# Altium schematic sheet hot_board.SchDoc
size A4
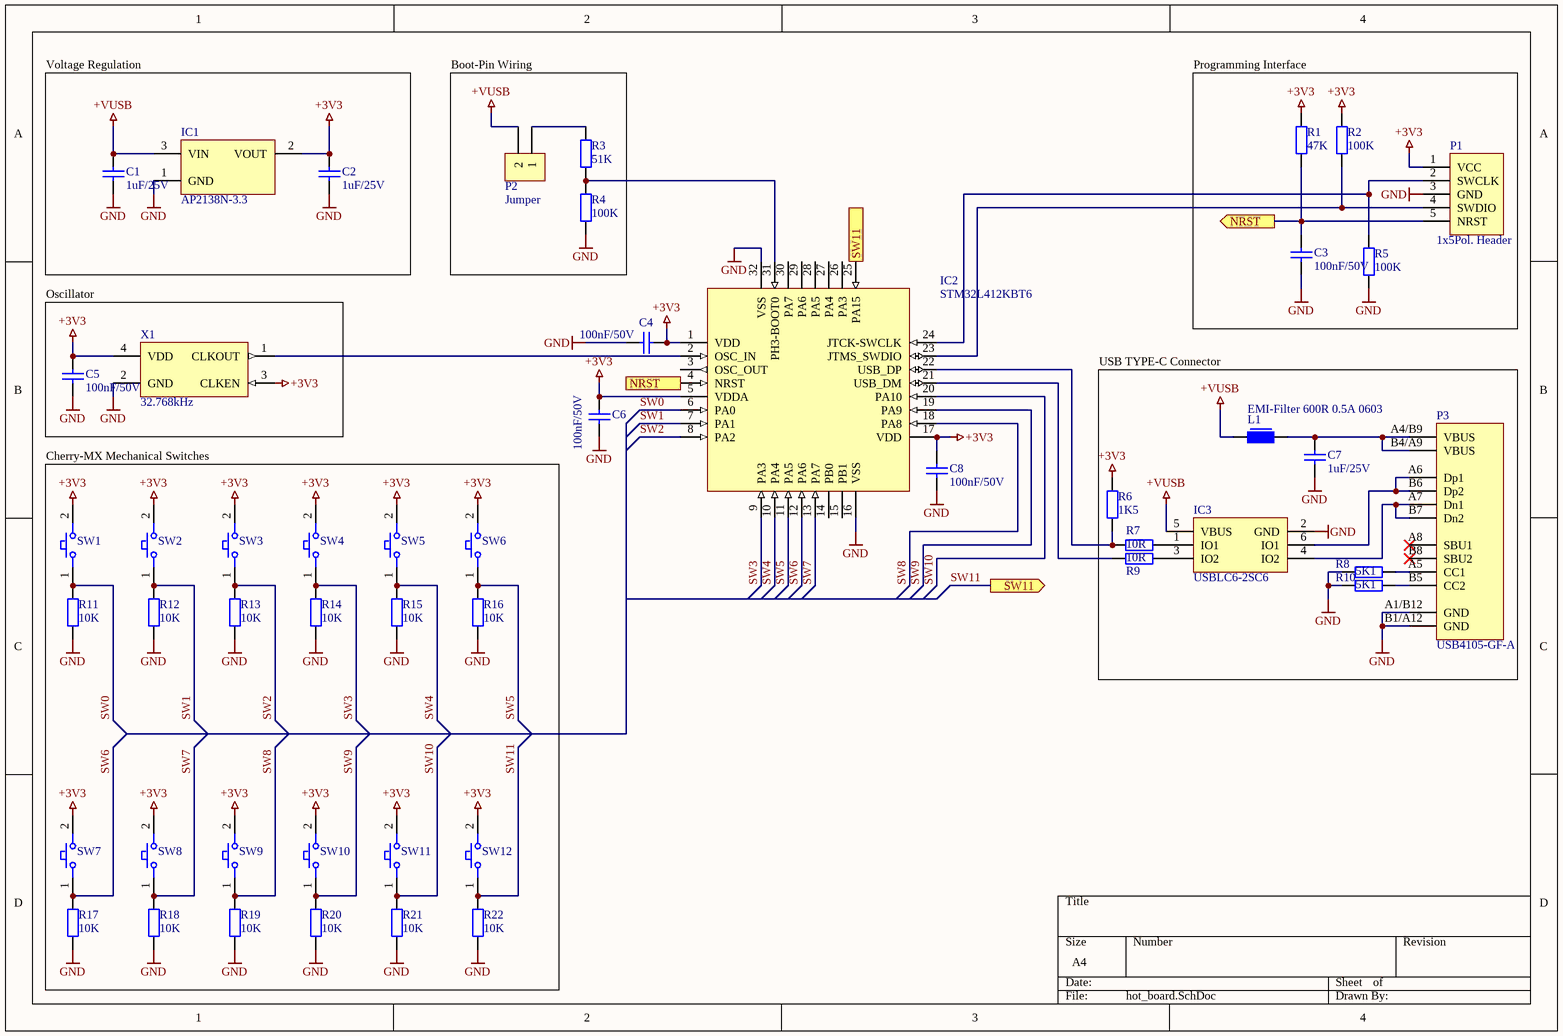
[diagram p0: hot_board.SchDoc]

## Parts
C1  1uF/25V  [0603]
C2  1uF/25V  [0603]
C3  100nF/50V  [0603]
C4  100nF/50V  [0603]
C5  100nF/50V  [0603]
C6  100nF/50V  [0603]
C7  1uF/25V  [0603]
C8  100nF/50V  [0603]
IC1  AP2138N-3.3  [SOT23-3]
IC2  STM32L412KBT6  [LQFP-32]
IC3  USBLC6-2SC6  [SOT23-6]
L1  EMI-Filter 600R 0.5A 0603  [0603]
P1  1x5Pol. Header  [1x5 Header]
P2  Jumper  [1x2 Header]
P3  USB4105-GF-A  [USB_SMD]
R1  47K  [0603]
R2  100K  [0603]
R3  51K  [0603]
R4  100K  [0603]
R5  100K  [0603]
R6  1K5  [0603]
R7  10R  [0603]
R8  5K1  [0603]
R9  10R  [0603]
R10  5K1  [0603]
R11  10K  [0603]
R12  10K  [0603]
R13  10K  [0603]
R14  10K  [0603]
R15  10K  [0603]
R16  10K  [0603]
R17  10K  [0603]
R18  10K  [0603]
R19  10K  [0603]
R20  10K  [0603]
R21  10K  [0603]
R22  10K  [0603]
SW1  Switch_Cherry_MX1A-E1NN_eec  [Cherry_MX1A-E1NN_0]  (value not drawn)
SW2  Switch_Cherry_MX1A-E1NN_eec  [Cherry_MX1A-E1NN_0]  (value not drawn)
SW3  Switch_Cherry_MX1A-E1NN_eec  [Cherry_MX1A-E1NN_0]  (value not drawn)
SW4  Switch_Cherry_MX1A-E1NN_eec  [Cherry_MX1A-E1NN_0]  (value not drawn)
SW5  Switch_Cherry_MX1A-E1NN_eec  [Cherry_MX1A-E1NN_0]  (value not drawn)
SW6  Switch_Cherry_MX1A-E1NN_eec  [Cherry_MX1A-E1NN_0]  (value not drawn)
SW7  Switch_Cherry_MX1A-E1NN_eec  [Cherry_MX1A-E1NN_0]  (value not drawn)
SW8  Switch_Cherry_MX1A-E1NN_eec  [Cherry_MX1A-E1NN_0]  (value not drawn)
SW9  Switch_Cherry_MX1A-E1NN_eec  [Cherry_MX1A-E1NN_0]  (value not drawn)
SW10  Switch_Cherry_MX1A-E1NN_eec  [Cherry_MX1A-E1NN_0]  (value not drawn)
SW11  Switch_Cherry_MX1A-E1NN_eec  [Cherry_MX1A-E1NN_0]  (value not drawn)
SW12  Switch_Cherry_MX1A-E1NN_eec  [Cherry_MX1A-E1NN_0]  (value not drawn)
X1  32.768kHz  [Quartz]

## Blocks framed on the sheet
Voltage Regulation: C1 C2 IC1
Boot-Pin Wiring: P2 R3 R4
Programming Interface: C3 P1 R1 R2 R5
Oscillator: C5 X1
USB TYPE-C Connector: C7 IC3 L1 P3 R6-R10
Cherry-MX Mechanical Switches: R11-R22 SW1-SW12

## Ports
NRST (in), NRST (out), SW11 (in), SW11 (out)

## Nets
+3V3: C2.1 C4.2 C5.2 C6.2 C8.2 IC1.2(VOUT) IC2.1(VDD) IC2.5(VDDA) IC2.17(VDD) P1.1(VCC) R1.2 R2.2 R6.1 SW1.2 SW2.2 SW3.2 SW4.2 SW5.2 SW6.2 SW7.2 SW8.2 SW9.2 SW10.2 SW11.2 SW12.2 X1.3(CLKEN) X1.4(VDD)
+VUSB: C1.1 IC1.3(VIN) IC3.5(VBUS) L1.1 P2.2
GND: C1.2 C2.2 C3.1 C4.1 C5.1 C6.1 C7.2 C8.1 IC1.1(GND) IC2.16(VSS) IC2.32(VSS) IC3.2(GND) P1.3(GND) P3.A1/B12(GND) P3.B1/A12(GND) R4.1 R5.1 R8.1 R10.1 R11.2 R12.2 R13.2 R14.2 R15.2 R16.2 R17.2 R18.2 R19.2 R20.2 R21.2 R22.2 X1.2(GND)
NRST: C3.2 IC2.4(NRST) P1.5(NRST) R1.1 ; port NRST
SW0: IC2.6(PA0) R11.1 SW1.1
SW1: IC2.7(PA1) R12.1 SW2.1
SW2: IC2.8(PA2) R13.1 SW3.1
SW3: IC2.9(PA3) R14.1 SW4.1
SW4: IC2.10(PA4) R15.1 SW5.1
SW5: IC2.11(PA5) R16.1 SW6.1
SW6: IC2.12(PA6) R17.1 SW7.1
SW7: IC2.13(PA7) R18.1 SW8.1
SW8: IC2.18(PA8) R19.1 SW9.1
SW9: IC2.19(PA9) R20.1 SW10.1
SW10: IC2.20(PA10) R21.1 SW11.1
SW11: IC2.25(PA15) R22.1 SW12.1 ; port SW11
NetC7_1: C7.1 L1.2 P3.A4/B9(VBUS) P3.B4/A9(VBUS)
NetIC2_2: IC2.2(OSC_IN) X1.1(CLKOUT)
NetIC2_21: IC2.21(USB_DM) R9.1
NetIC2_22: IC2.22(USB_DP) R6.2 R7.1
NetIC2_23: IC2.23(JTMS_SWDIO) P1.4(SWDIO) R2.1
NetIC2_24: IC2.24(JTCK-SWCLK) P1.2(SWCLK) R5.2
NetIC2_31: IC2.31(PH3-BOOT0) R3.1 R4.2
NetIC3_1: IC3.1(IO1) R7.2
NetIC3_3: IC3.3(IO2) R9.2
NetIC3_4: IC3.4(IO2) P3.A7(Dn1) P3.B7(Dn2)
NetIC3_6: IC3.6(IO1) P3.A6(Dp1) P3.B6(Dp2)
NetP2_1: P2.1 R3.2
NetP3_A5: P3.A5(CC1) R8.2
NetP3_B5: P3.B5(CC2) R10.2

Not connected (* = marked no-connect by the designer): IC2 3(OSC_OUT) 14(PB0) 15(PB1) 26(PA3) 27(PA4) 28(PA5) 29(PA6) 30(PA7); P3 A8(SBU1)* B8(SBU2)*

## Library data of the parts
C1 C2 C7 = 1uF_0603_25V: Keramikkondensator, 1uF, 25V, 10%, SMD 0603, X5R; Artikelnummer_HEK: 1280791; Artikelnummer_FA: 1735540; Richtpreis_EURO: 0.01; Artikelnummer_MOU: 80-C0603C105K3PAC; Hersteller: Kemet; Artikelnummer_SAP: *; Artikelnummer_DIS: *; Info: *; Datum: 03.10.2010; HelpURL: *; Bestückung: *; Dielektrikum: X5R
C3-C6 C8 = 100nF_0603_50V: Keramikkondensator, 100nF, 50V, 10%, SMD 0603, X7R; Artikelnummer_HEK: 1280316; Artikelnummer_FA: 1362556; Richtpreis_EURO: 0.0017; Artikelnummer_DIS: *; Artikelnummer_SAP: *; Info: *; Datum: 08.06.06; HelpURL: http://hk79295n10/idmws/doccontent.dll?library=hekatron^hk79295n11&id=003751259
IC1 = AP2138N-3.3: PMIC - Spannungsregler - Linear 1 Ausgang 250mA SOT-23-3
IC2 = STM32L412KBT6: Ultra-low-power with FPU Arm Cortex-M4 MCU 80 MHz with 128-Kbyte of Flash memory, USB
IC3 = USBLC6-2SC6: 17V Klemme 5 A (8/20µs) Ipp TVS - Dioden Oberflächenmontage SOT-23-6
L1 = EMI-Filter 600R 0.5A 0603: Ferrit EMI Filter, 100MHz, 25%, 600 Ohm, 0.5A, SMD 0603; Artikelnummer_HEK: 1020415; Artikelnummer_FA: 1515723; Info: Murata: BLM18EG601SN1D; Richtpreis_EURO: 0.0183; Artikelnummer_SAP: *; Artikelnummer_DIS: *; Datum: 10.06.12; Bestückung: *; HelpURL: *
P1 = SWD-Connector: SWD Connector for Programming
P2 = Jumper: Header 1x2pol; Artikelnummer_HEK: 2520674; Richtpreis_EURO: 0.2; System: Connector; SMD: N; HelpURL: http://dmshekatron.securiton.int/idmwsout/doccontent.dll?library=hekatron^hk79295n11&id=004881205; Artikelnummer_DIS: *; Artikelnummer_FA: *; Artikelnummer_SAP: *; Datum: *; Info: *; Bestückung: *
P3 = USB_C_Connector: USB4105-GF-A‎ / USB2.0 TYPEC
R1 = 47K_0603_0.125W: 47K Chip-Widerstand, 1%, 0.125W, 0603; Artikelnummer_HEK: 1191450; Artikelnummer_FA: 1576305; Artikelnummer_DIS: 715628; Richtpreis_EURO: 0.01; Artikelnummer_SAP: *; Datum: 20.12.06; Info: *; HelpURL: http://hk79295n10/idmws/doccontent.dll?library=hekatron^hk79295n11&id=004062332; Bestückung: *
R2 R4 R5 = 100K_0603_0.1W: 100K Chip-Widerstand, 1%, 0.063W, 0603; Artikelnummer_HEK: 1190787; Richtpreis_EURO: 0.0003; Artikelnummer_SAP: *; Artikelnummer_DIS: *; Artikelnummer_FA: *; Info: *; Datum: 20.03.14; Bestückung: *; HelpURL: *
R3 = 51K_0603_0.1W: 51K Chip-Widerstand, 1%. 0.1W, 0603; Artikelnummer_HEK: 1191872; Artikelnummer_FA: 1799349; Richtpreis_EURO: 0.01; Artikelnummer_DIS: *; Artikelnummer_SAP: *; Info: *; Datum: 14.05.10; HelpURL: http://hk79295n10/IDMWSout/doccontent.dll?library=hekatron^hk79295n11&id=004064519; Bestückung: *
R6 = 1K5_0603_0.100W: 1K5 Chip-Widerstand, 1%, 0.100W, 0603; Artikelnummer_HEK: 1191340; Richtpreis_EURO: 0.0004; Artikelnummer_DIS: *; Artikelnummer_SAP: *; Artikelnummer_FA: *; Datum: 20.03.14; Info: *; Bestückung: *; HelpURL: *
R7 R9 = 10R_0603_0.125W: 10R Chip-Widerstand, 1%, 0.125W, 0603; Artikelnummer_HEK: 1191543; Artikelnummer_FA: 1576250; Richtpreis_EURO: 0.01; Artikelnummer_DIS: *; Artikelnummer_SAP: *; Info: *; Datum: 26.04.06; Bestückung: *; HelpURL: *
R8 R10 = 5K1_0603_0.1W: 5K1 Chip-Widerstand, 1%. 0.1W, 0603; Artikelnummer_HEK: 1191429; Artikelnummer_DIS: 715605; Richtpreis_EURO: 0.0004; Artikelnummer_FA: *; Info: *; Datum: 26.04.06
R11-R22 = 10K_0603_0.1W: 10K Chip-Widerstand, 1%, 0.1W, 0603; Artikelnummer_HEK: 1190782; Richtpreis_EURO: 0.0001; Artikelnummer_FA: *; Artikelnummer_DIS: *; Artikelnummer_SAP: *; Info: *; Datum: 20.03.14; Bestückung: *; HelpURL: *
SW1-SW12 = Switch_Cherry_MX1A-E1NN_eec: SWITCH Pushbutton Switch SPST-NO Keyswitch Panel Mount, Front; Manufacturer: Cherry; Current: 10mA AC/DC max. 10µA DC min.; Voltage: 12 VAC/DC max. 2 VDC min.; Part Number: MX1A-E1NN; helpURL: https://upverter.com/upn/revision/05edf2e9883387c2/; ComponentLink2Description: Datasheet; Temperature: -10°C to +70°C; Package: SMT_SW_15MM6_15MM6; Supplier 2: Mouser; Price: 0.741007758432; Supplier 1: Digi-Key; ComponentLink1URL: https://upverter.com/upn/revision/05edf2e9883387c2/; Supplier Part Number 2: 540-MX1A-E1NN; Supplier Part Number 1: CH196-ND; ComponentLink1Description: Upverter; ComponentLink2URL: https://upverter.com/datasheet/a174b925b05052267a652262a41f429ea7a87855.pdf; RoHS: TRUE; Mouser Part Number: 540-MX1A-E1NN; Temperature Range High: +70°C; Digikey Description: SWITCH Pushbutton Switch SPST-NO Keyswitch Panel Mount, Front; Digikey Part Number: CH196-ND; Lead Free: yes; Circuit: SPST-NO; Temperature Range Low: -10°C
X1 = Oszillator_32.765kHz: 32,768kHz CMOS XO-Norm Oszillator 1,2V bis 5,5V Aktivieren/Deaktivieren 4-SMD, ohne Anschlüsse